# Altium schematic sheet HMC2003_module.SchDoc
size A1
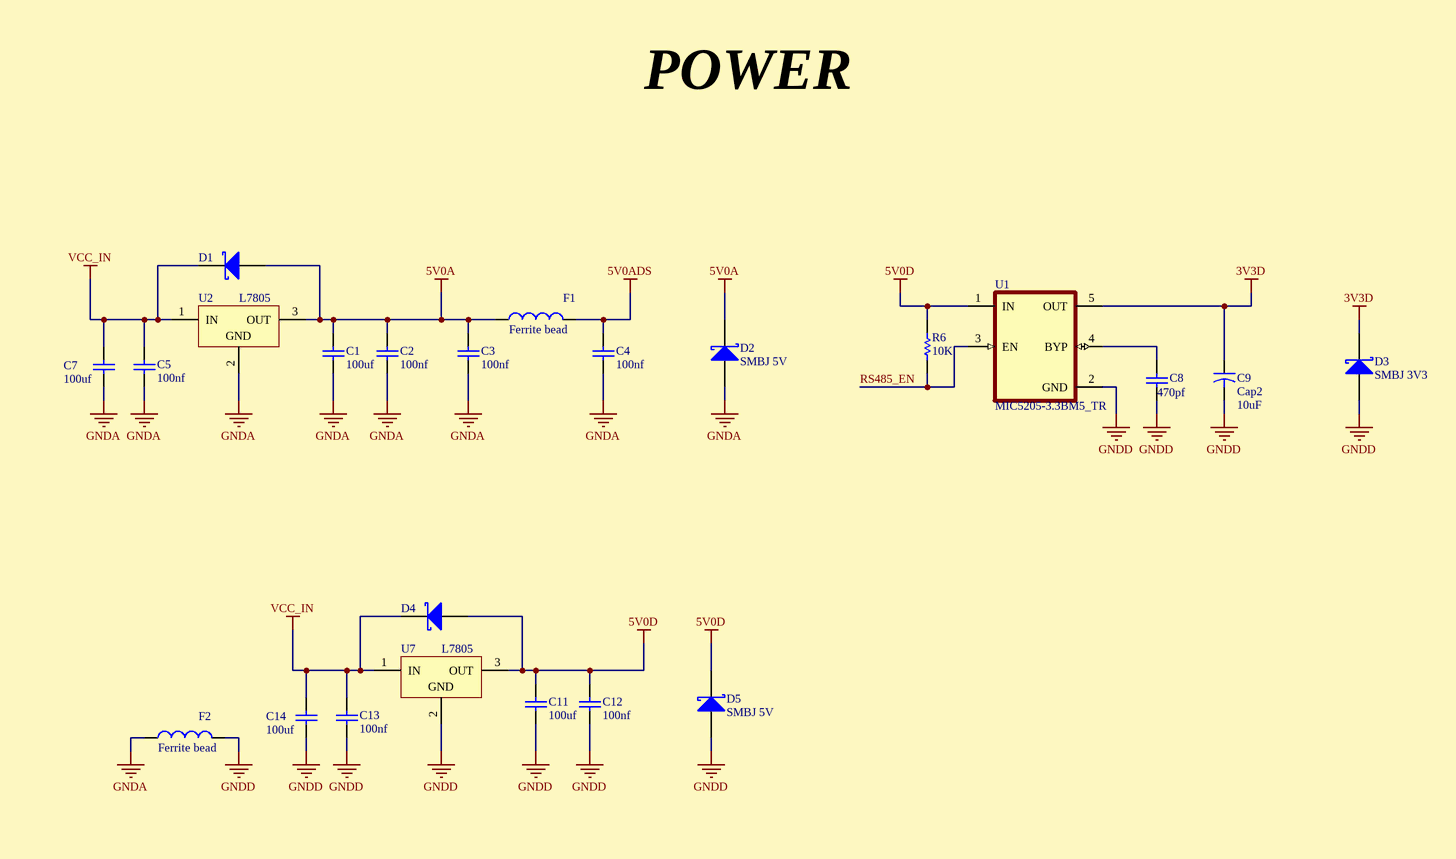
[diagram p0: HMC2003_module.SchDoc, top left]
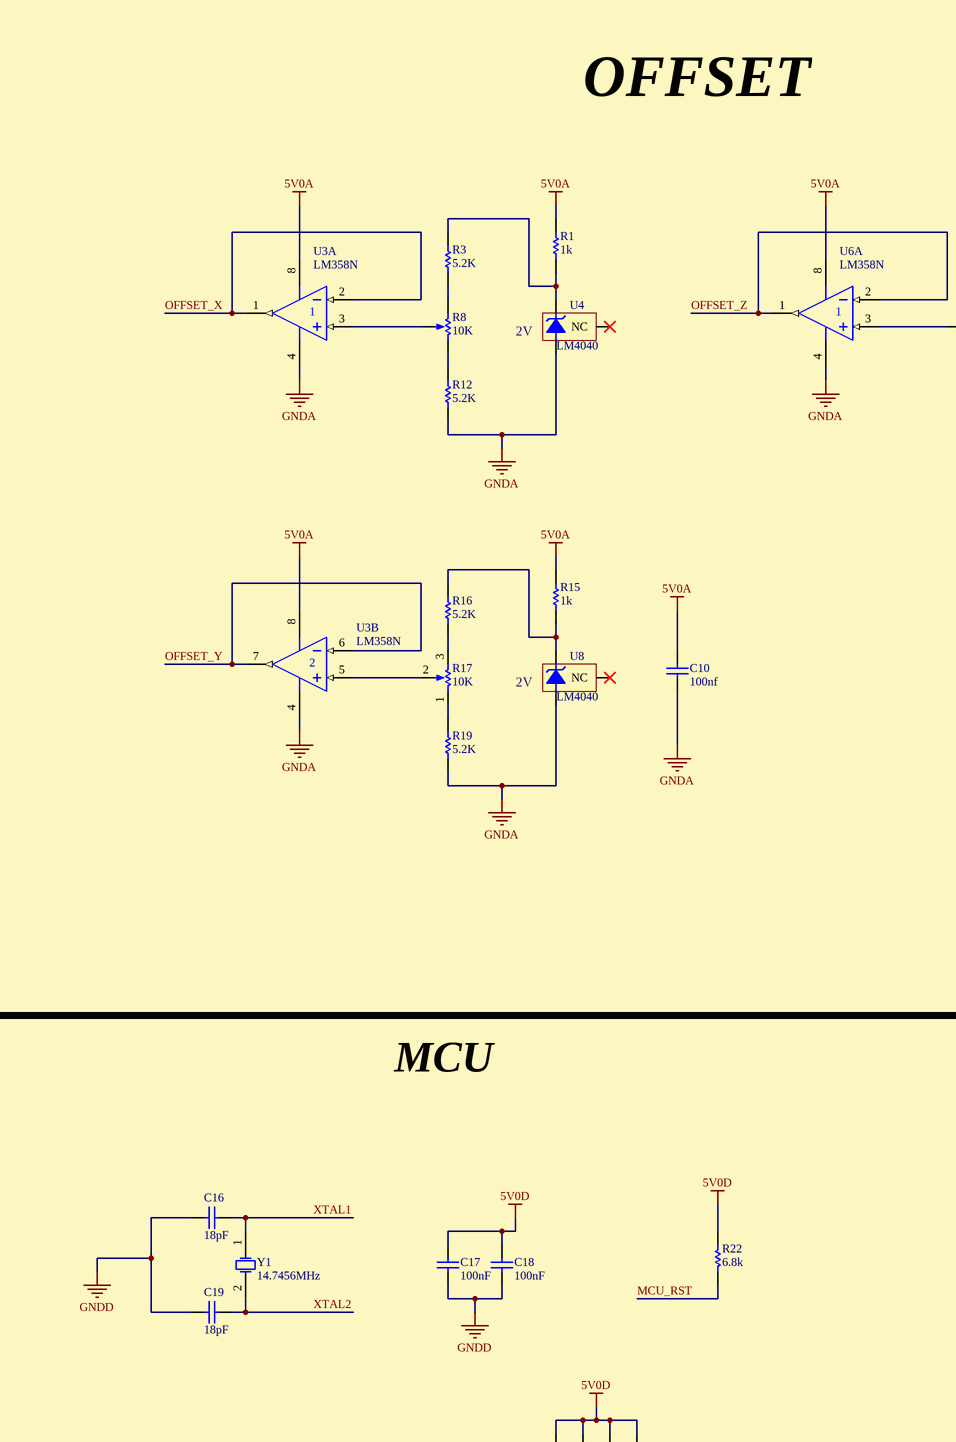
[diagram p1: HMC2003_module.SchDoc, top middle]
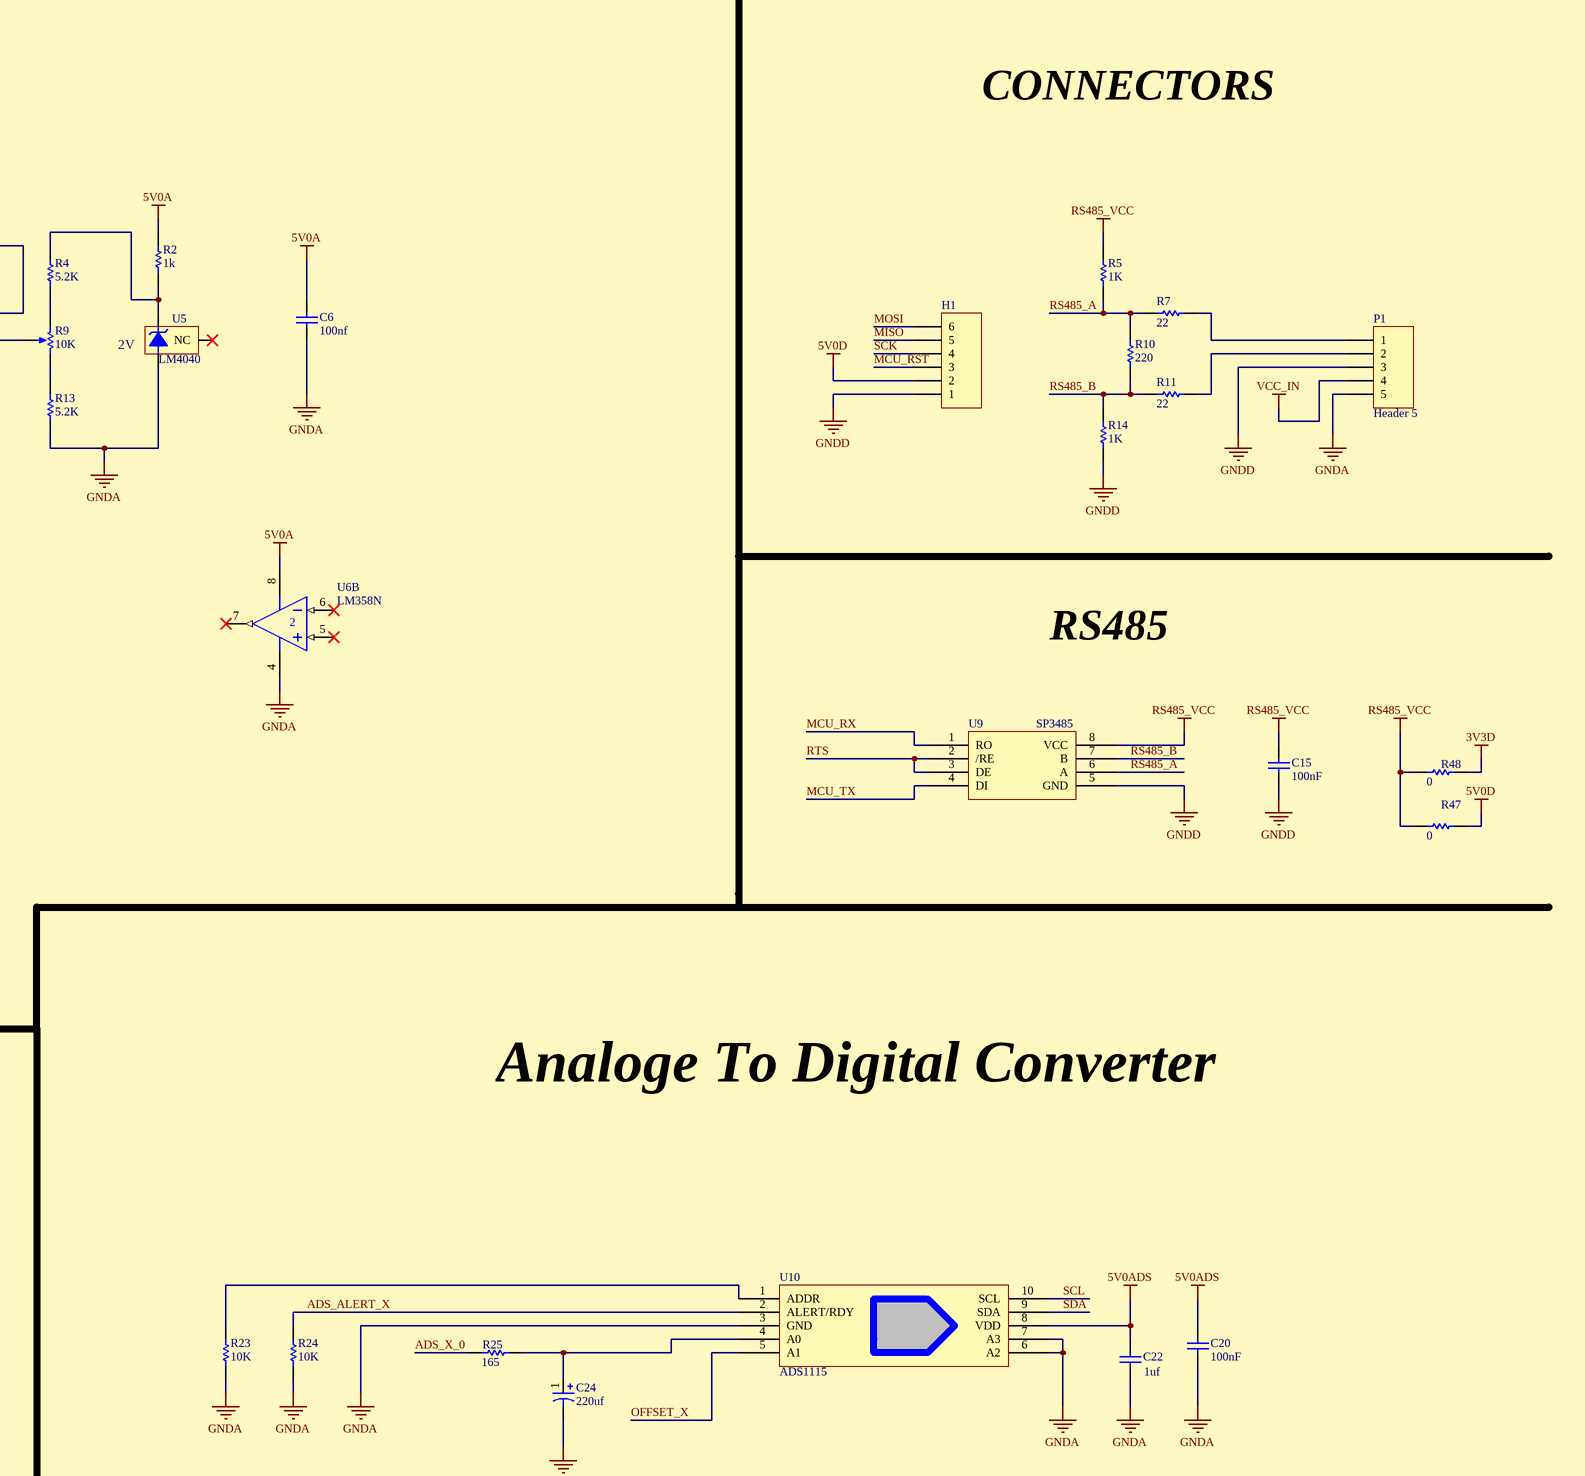
[diagram p2: HMC2003_module.SchDoc, top right]
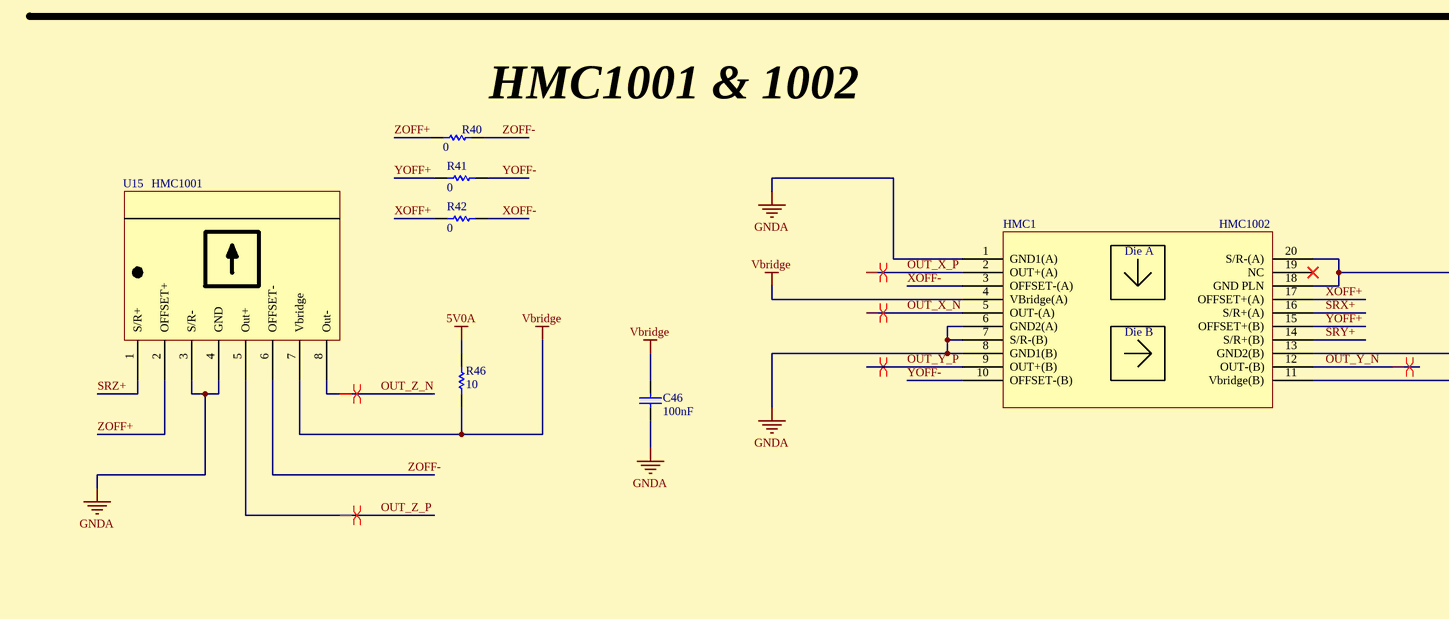
[diagram p3: HMC2003_module.SchDoc, bottom left]
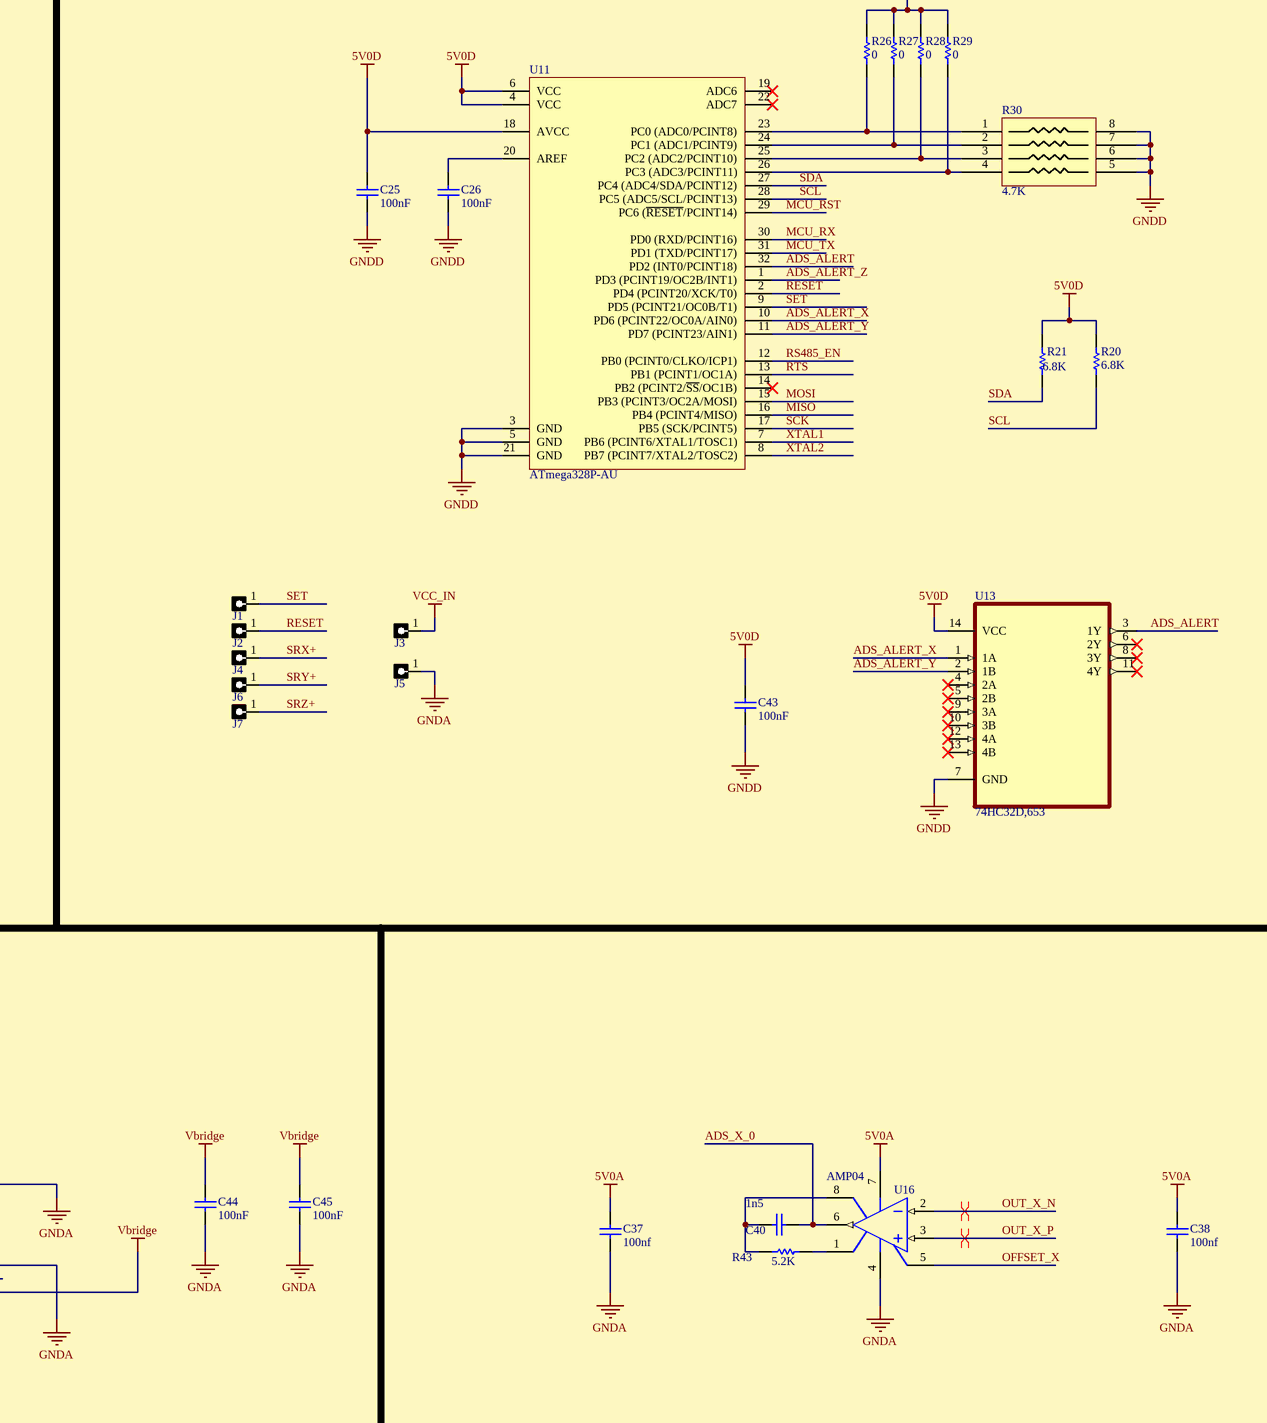
[diagram p4: HMC2003_module.SchDoc, bottom middle]
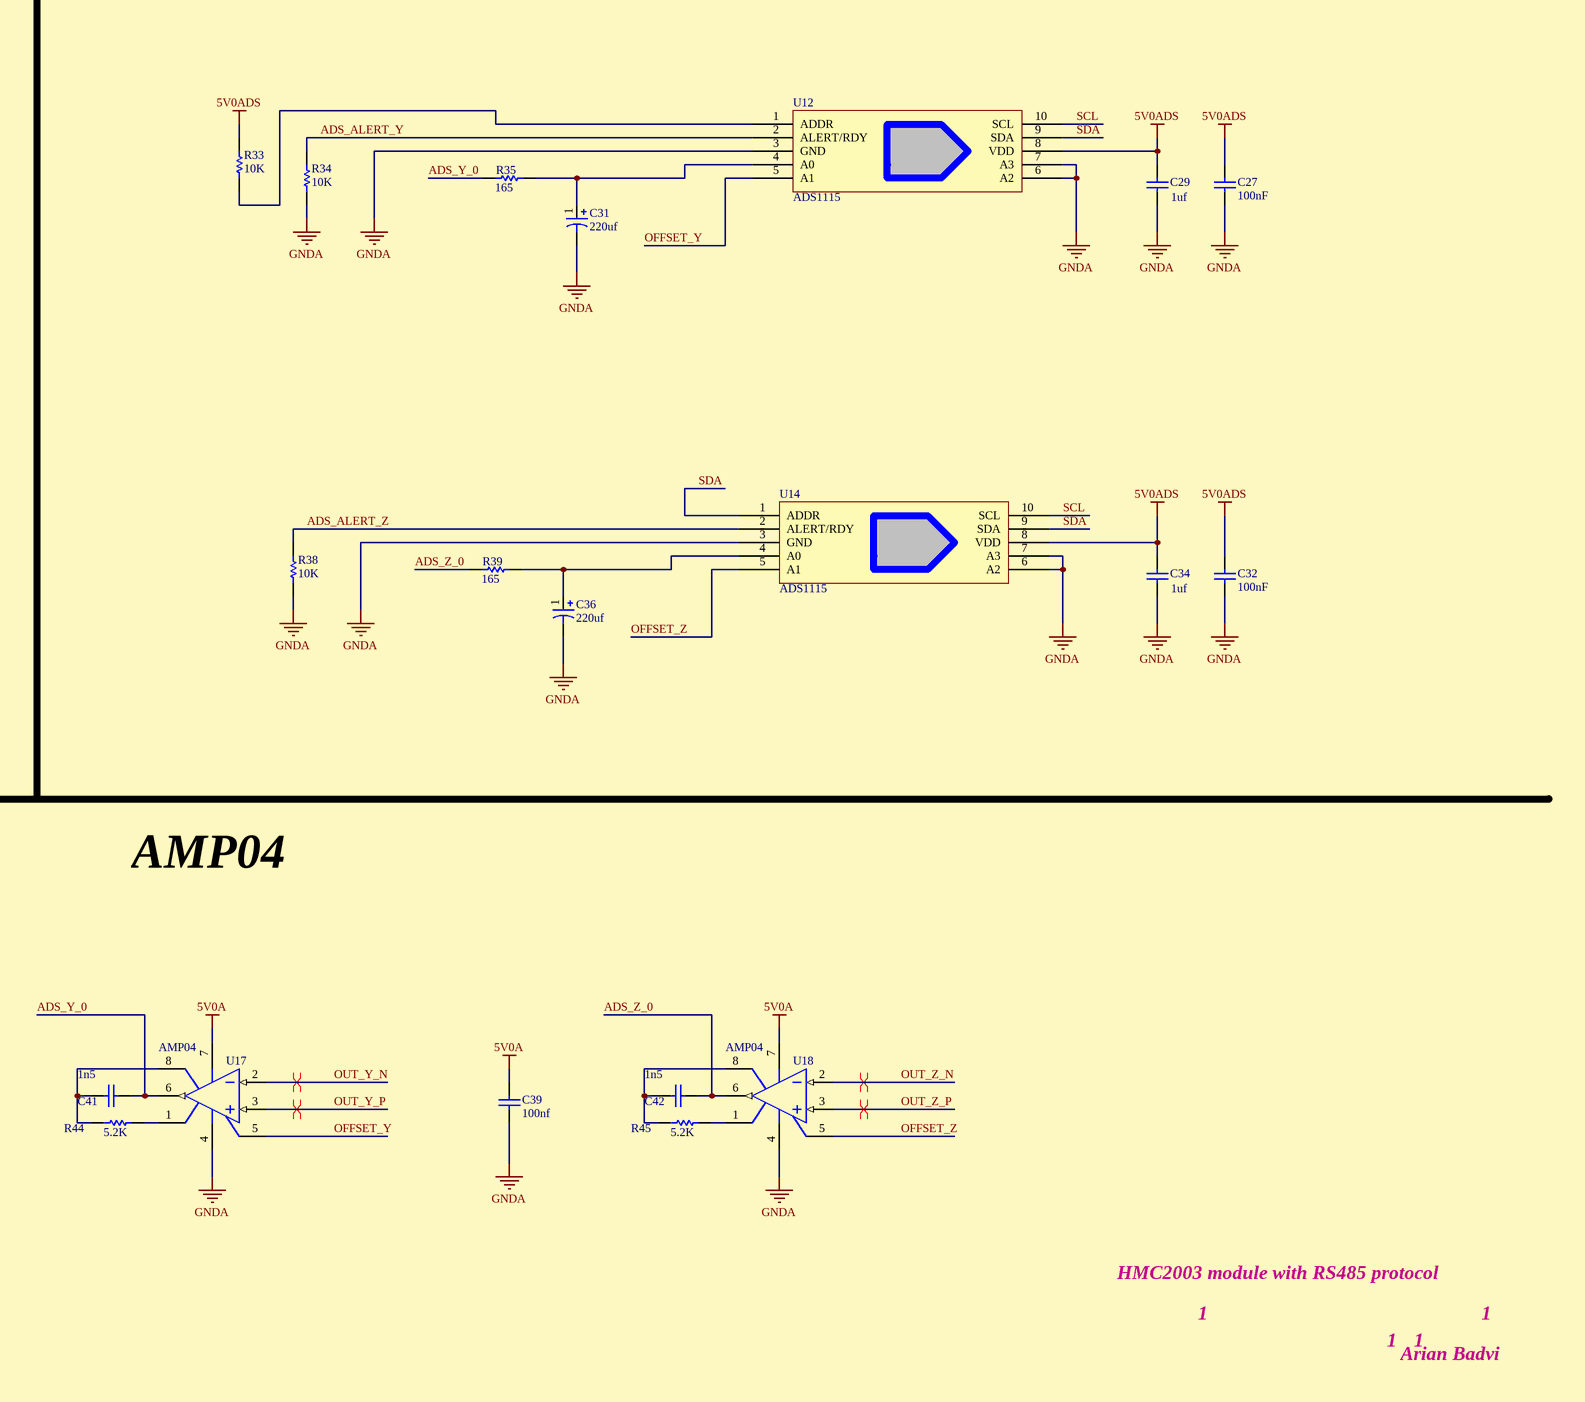
[diagram p5: HMC2003_module.SchDoc, bottom right]

## Parts
C1  100uf  [C1206]
C2  100nf  [C0805]
C3  100nf  [C0805]
C4  100nf  [C0805]
C5  100nf  [C0805]
C6  100nf  [C0805]
C7  100uf  [C1206]
C8  470pf  [C0805]
C9  Cap2  value 10uF  [CAP_SMD_A]
C10  100nf  [C0805]
C11  100uf  [C1206]
C12  100nf  [C0805]
C13  100nf  [C0805]
C14  100uf  [C1206]
C15  100nF  [C0805]
C16  18pF  [C0805]
C17  100nF  [C0805]
C18  100nF  [C0805]
C19  18pF  [C0805]
C20  100nF  [C0805]
C22  1uf  [C0805]
C24  220uf  [cap_smd_d]
C25  100nF  [C0805]
C26  100nF  [C0805]
C27  100nF  [C0805]
C29  1uf  [C0805]
C31  220uf  [cap_smd_d]
C32  100nF  [C0805]
C34  1uf  [C0805]
C36  220uf  [cap_smd_d]
C37  100nf  [C0805]
C38  100nf  [C0805]
C39  100nf  [C0805]
C40  1n5  [C0805]
C41  1n5  [C0805]
C42  1n5  [C0805]
C43  100nF  [C0805]
C44  100nF  [C0805]
C45  100nF  [C0805]
C46  100nF  [C0805]
D1  D Schottky  [ZENER]  (value not drawn)
D2  SMBJ 5V  [TVS]
D3  SMBJ 3V3  [TVS]
D4  D Schottky  [ZENER]  (value not drawn)
D5  SMBJ 5V  [TVS]
F1  Ferrite bead  [0805]
F2  Ferrite bead  [0805]
H1  White SMD Connector 6pin  [PB_6_SMD]  (value not drawn)
HMC1  HMC1002  [SO_20_W]
J1  HDRF1  [HDR_F_1]  (value not drawn)
J2  HDRF1  [HDR_F_1]  (value not drawn)
J3  HDRF1  [HDR_F_1]  (value not drawn)
J4  HDRF1  [HDR_F_1]  (value not drawn)
J5  HDRF1  [HDR_F_1]  (value not drawn)
J6  HDRF1  [HDR_F_1]  (value not drawn)
J7  HDRF1  [HDR_F_1]  (value not drawn)
P1  Header 5  [HDR_M_1x5]
R1  1k  [0805]
R2  1k  [0805]
R3  5.2K  [0805]
R4  5.2K  [0805]
R5  1K  [0805]
R6  10K  [0805]
R7  22  [0805]
R8  value 10K  [POT_3296w]  (hidden comment: RPot)
R9  value 10K  [POT_3296w]  (hidden comment: RPot)
R10  220  [0805]
R11  22  [0805]
R12  5.2K  [0805]
R13  5.2K  [0805]
R14  1K  [0805]
R15  1k  [0805]
R16  5.2K  [0805]
R17  value 10K  [POT_3296w]  (hidden comment: RPot)
R19  5.2K  [0805]
R20  6.8K  [0805]
R21  6.8K  [0805]
R22  6.8k  [0805]
R23  10K  [0805]
R24  10K  [0805]
R25  165  [0805]
R26  0  [0603]
R27  0  [0603]
R28  0  [0603]
R29  0  [0603]
R30  4.7K  [RP0603X4]
R33  10K  [0805]
R34  10K  [0805]
R35  165  [0805]
R38  10K  [0805]
R39  165  [0805]
R40  0  [0603]
R41  0  [0603]
R42  0  [0603]
R43  5.2K  [0805]
R44  5.2K  [0805]
R45  5.2K  [0805]
R46  10  [0805]
R47  0  [0603]
R48  0  [0603]
U1  MIC5205-3.3BM5_TR  [SOT23_5]
U2  L7805  [DPAK]
U3  LM358N  [sop8]  (parts A,B of 2)
U4  LM4040  [sot-23]
U5  LM4040  [sot-23]
U6  LM358N  [sop8]  (parts A,B of 2)
U7  L7805  [DPAK]
U8  LM4040  [sot-23]
U9  SP3485  [SOP8]
U10  ADS1115  [TSSOP10_N]
U11  ATmega328P-AU  [32A_L]
U12  ADS1115  [TSSOP10_N]
U13  74HC32D,653  [SOG65_14]
U14  ADS1115  [TSSOP10_N]
U15  HMC1001  [HMC1001_V]
U16  AMP04  [sop8]
U17  AMP04  [sop8]
U18  AMP04  [sop8]
Y1  14.7456MHz  [XTAL_SMD]

## Nets
3V3D: C9.1 D3.1(K) R48.1 U1.5(OUT)
5V0A: C1.2 C2.2 C3.2 C6.2 C10.2 C37.2 C38.2 C39.2 D1.1(A) D2.2(K) F1.1 R1.2 R2.2 R15.2 R46.2 U2.3(OUT) U3.8(V+) U6.8(V+) U16.7(V+) U17.7(V+) U18.7(V+)
5V0ADS: C4.2 C20.2 C22.2 C27.2 C29.2 C32.2 C34.2 F1.2 R33.2 U10.8(VDD) U12.8(VDD) U14.8(VDD)
5V0D: C11.2 C12.2 C17.2 C18.2 C25.2 C43.2 D4.1(A) D5.2(K) H1.2 R6.1 R20.1 R21.1 R22.1 R26.1 R27.1 R28.1 R29.1 R47.1 U1.1(IN) U7.3(OUT) U11.4(VCC) U11.6(VCC) U11.18(AVCC) U13.14(VCC)
GNDA: C1.1 C2.1 C3.1 C4.1 C5.1 C6.1 C7.1 C10.1 C20.1 C22.1 C24.2 C27.1 C29.1 C31.2 C32.1 C34.1 C36.2 C37.1 C38.1 C39.1 C44.1 C45.1 C46.1 D2.1(A) F2.1 HMC1.1(GND1(A)) HMC1.6(GND2(A)) HMC1.7(S/R-(B)) HMC1.8(GND1(B)) HMC1.13(GND2(B)) HMC1.18(GND_PLN) HMC1.20(S/R-(A)) J5.1 P1.5 R12.1 R13.1 R19.1 R23.1 R24.1 R34.1 R38.1 U2.2(GND) U3.4(V-) U4.2(-V) U5.2(-V) U6.4(V-) U8.2(-V) U10.3(GND) U10.6(A2) U10.7(A3) U12.3(GND) U12.6(A2) U12.7(A3) U14.3(GND) U14.6(A2) U14.7(A3) U15.3(S/R-) U15.4(GND) U16.4(V-) U17.4(V-) U18.4(V-)
GNDD: C8.1 C9.2 C11.1 C12.1 C13.1 C14.1 C15.1 C16.1 C17.1 C18.1 C19.1 C25.1 C26.1 C43.1 D3.2(A) D5.1(A) F2.2 H1.1 P1.3 R14.1 R30.5 R30.6 R30.7 R30.8 U1.2(GND) U7.2(GND) U9.5(GND) U11.3(GND) U11.5(GND) U11.21(GND) U13.7(GND)
RS485_VCC: C15.2 R5.2 R47.2 R48.2 U9.8(VCC)
Vbridge: C44.2 C45.2 C46.2 HMC1.4(VBridge(A)) HMC1.11(Vbridge(B)) R46.1 U15.7(Vbridge)
VCC_IN: C5.2 C7.2 C13.2 C14.2 D1.2(K) D4.2(K) J3.1 P1.4 U2.1(IN) U7.1(IN)
ADS_ALERT: U11.32(PD2_(INT0/PCINT18)) U13.3(1Y)
ADS_ALERT_X: R24.2 U10.2(ALERT/RDY) U11.10(PD6_(PCINT22/OC0A/AIN0)) U13.1(1A)
ADS_ALERT_Y: R34.2 U11.11(PD7_(PCINT23/AIN1)) U12.2(ALERT/RDY) U13.2(1B)
ADS_ALERT_Z: R38.2 U11.1(PD3_(PCINT19/OC2B/INT1)) U14.2(ALERT/RDY)
ADS_X_0: C40.1 R25.1 U16.6(OUT)
ADS_Y_0: C41.1 R35.1 U17.6(OUT)
ADS_Z_0: C42.1 R39.1 U18.6(OUT)
MCU_RST: H1.3 R22.2 U11.29(PC6_(~{RESET}/PCINT14))
MCU_RX: U9.1(RO) U11.30(PD0_(RXD/PCINT16))
MCU_TX: U9.4(DI) U11.31(PD1_(TXD/PCINT17))
MISO: H1.5 U11.16(PB4_(PCINT4/MISO))
MOSI: H1.6 U11.15(PB3_(PCINT3/OC2A/MOSI))
OFFSET_X: U3.1(OUT) U3.2(IN-) U10.5(A1) U16.5(OS_NUL)
OFFSET_Y: U3.6(IN-) U3.7(OUT) U12.5(A1) U17.5(OS_NUL)
OFFSET_Z: U6.1(OUT) U6.2(IN-) U14.5(A1) U18.5(OS_NUL)
OUT_X_N: HMC1.5(OUT-(A)) U16.2(IN-)
OUT_X_P: HMC1.2(OUT+(A)) U16.3(IN+)
OUT_Y_N: HMC1.12(OUT-(B)) U17.2(IN-)
OUT_Y_P: HMC1.9(OUT+(B)) U17.3(IN+)
OUT_Z_N: U15.8(Out-) U18.2(IN-)
OUT_Z_P: U15.5(Out+) U18.3(IN+)
RESET: J2.1 U11.2(PD4_(PCINT20/XCK/T0))
RS485_A: R5.1 R7.1 R10.1 U9.6(A)
RS485_B: R10.2 R11.1 R14.2 U9.7(B)
RS485_EN: R6.2 U1.3(EN) U11.12(PB0_(PCINT0/CLKO/ICP1))
RTS: U9.2(/RE) U9.3(DE) U11.13(PB1_(PCINT1/OC1A))
SCK: H1.4 U11.17(PB5_(SCK/PCINT5))
SCL: R20.2 U10.10(SCL) U11.28(PC5_(ADC5/SCL/PCINT13)) U12.10(SCL) U14.10(SCL)
SDA: R21.2 U10.9(SDA) U11.27(PC4_(ADC4/SDA/PCINT12)) U12.9(SDA) U14.1(ADDR) U14.9(SDA)
SET: J1.1 U11.9(PD5_(PCINT21/OC0B/T1))
SRX+: HMC1.16(S/R+(A)) J4.1
SRY+: HMC1.14(S/R+(B)) J6.1
SRZ+: J7.1 U15.1(S/R+)
XOFF+: HMC1.17(OFFSET+(A)) R42.2
XOFF-: HMC1.3(OFFSET-(A)) R42.1
XTAL1: C16.2 U11.7(PB6_(PCINT6/XTAL1/TOSC1)) Y1.1(OSC1)
XTAL2: C19.2 U11.8(PB7_(PCINT7/XTAL2/TOSC2)) Y1.2(OSC2)
YOFF+: HMC1.15(OFFSET+(B)) R41.2
YOFF-: HMC1.10(OFFSET-(B)) R41.1
ZOFF+: R40.2 U15.2(OFFSET+)
ZOFF-: R40.1 U15.6(OFFSET-)
NetC8_2: C8.2 U1.4(BYP)
NetC24_1: C24.1 R25.2 U10.4(A0)
NetC26_2: C26.2 U11.20(AREF)
NetC31_1: C31.1 R35.2 U12.4(A0)
NetC36_1: C36.1 R39.2 U14.4(A0)
NetC40_2: C40.2 R43.1 U16.8(TAB)
NetC41_2: C41.2 R44.1 U17.8(TAB)
NetC42_2: C42.2 R45.1 U18.8(TAB)
NetP1_1: P1.1 R7.2
NetP1_2: P1.2 R11.2
NetR1_1: R1.1 R3.2 U4.1(+V)
NetR2_1: R2.1 R4.2 U5.1(+V)
NetR3_1: R3.1 R8.3(BOT)
NetR4_1: R4.1 R9.3(BOT)
NetR8_1: R8.1(TOP) R12.2
NetR8_2: R8.2(TAP) U3.3(IN+)
NetR9_1: R9.1(TOP) R13.2
NetR9_2: R9.2(TAP) U6.3(IN+)
NetR15_1: R15.1 R16.2 U8.1(+V)
NetR16_1: R16.1 R17.3(BOT)
NetR17_1: R17.1(TOP) R19.2
NetR17_2: R17.2(TAP) U3.5(IN+)
NetR23_2: R23.2 U10.1(ADDR)
NetR26_2: R26.2 R30.1 U11.23(PC0_(ADC0/PCINT8))
NetR27_2: R27.2 R30.2 U11.24(PC1_(ADC1/PCINT9))
NetR28_2: R28.2 R30.3 U11.25(PC2_(ADC2/PCINT10))
NetR29_2: R29.2 R30.4 U11.26(PC3_(ADC3/PCINT11))
NetR33_1: R33.1 U12.1(ADDR)
NetR43_2: R43.2 U16.1(OS_NUL)
NetR44_2: R44.2 U17.1(OS_NUL)
NetR45_2: R45.2 U18.1(OS_NUL)

Not connected (* = marked no-connect by the designer): HMC1 19(NC)*; U4 3(NC)*; U5 3(NC)*; U6 5(IN+)* 6(IN-)* 7(OUT)*; U8 3(NC)*; U11 14(PB2_(PCINT2/~{SS}/OC1B))* 19(ADC6)* 22(ADC7)*; U13 4(2A)* 5(2B)* 6(2Y)* 8(3Y)* 9(3A)* 10(3B)* 11(4Y)* 12(4A)* 13(4B)*

## Layout directives
differential pair: OUT_X_N, OUT_X_P, OUT_Y_N, OUT_Y_P, OUT_Z_N, OUT_Z_P

## Notes on the sheet
- POWER
- OFFSET
- CONNECTORS
- (near U4) 2V
- (near U5) 2V
- RS485
- (near U8) 2V
- MCU
- Analoge To Digital Converter
- (near R40) HMC1001 & 1002
- AMP04
- HMC2003 module with RS485 protocol
- 1
- Arian Badvi
- (in symbol HMC1002) Die A; Die B

## Library data of the parts
C1-C5 C7 C8 C11-C14 C22 C29 C34 = Cap: Capacitor, 1206; Published: 8-Jun-2000; LatestRevisionDate: 17-Jul-2002; LatestRevisionNote: Re-released for DXP Platform.; PackageReference: RAD-0.3; Publisher: Altium Limited
  C1 C7 C11 C14: Value: 100uf
  C2-C5 C12 C13: Value: 100nf
  C8: PackageDescription: Radial Cap, Thru-Hole; 2 Leads; 0.3 in Pin Spacing; Value: 470pf
  C22 C29 C34: PackageDescription: Radial Cap, Thru-Hole; 2 Leads; 0.3 in Pin Spacing; Value: 1uf
C6 C10 C15-C20 C25-C27 C32 C37-C46 = Cap: Capacitor; Published: 8-Jun-2000; LatestRevisionDate: 17-Jul-2002; LatestRevisionNote: Re-released for DXP Platform.; PackageReference: RAD-0.3; Publisher: Altium Limited
  C6 C10 C37-C39: PackageDescription: Radial Cap, Thru-Hole; 2 Leads; 0.3 in Pin Spacing; Value: 100nf
  C15 C17 C18 C20 C25-C27 C32 C43-C46: Value: 100nF
  C16 C19: Value: 18pF
  C40-C42: PackageDescription: Radial Cap, Thru-Hole; 2 Leads; 0.3 in Pin Spacing; Value: 1n5
C9 = Cap2: Capacitor, 10uf; Published: 23-Sep-2002; PackageReference: CAPR5-4X5; Publisher: Altium Limited
C24 C31 C36 = Cap Pol1: TAN CAP D SIZE; Published: 8-Jun-2000; LatestRevisionDate: 17-Jul-2002; LatestRevisionNote: Re-released for DXP Platform.; PackageReference: RB7.6-15; Publisher: Altium Limited; PackageDescription: Polarized Capacitor (Radial); 2 Leads; Value: 220uf
D1 D4 = D Schottky: Schottky Diode, 1N4148; Published: 8-Jun-2000; LatestRevisionDate: 17-Jul-2002; LatestRevisionNote: Re-released for DXP Platform.; PackageReference: SMB; Publisher: Altium Limited; Code_JEDEC: DO-214-AA
D2 D5 = Diode 18TQ045: Schottky Rectifier; Note: Terminal 2 is the TAB and is electrically connected to the cathode; Published: 8-Jun-2000; LatestRevisionDate: 17-Jul-2002; LatestRevisionNote: Re-released for DXP Platform.; DatasheetVersion: Dec-1997; PackageVersion: Feb-1998; PackageReference: TO-220AC; Publisher: Altium Limited; ComponentLink1Description: Manufacturer Link; ComponentLink1URL: http://www.irf.com/; ComponentLink2Description: Datasheet; ComponentLink2URL: http://www.irf.com/product-info/datasheets/data/18tq.pdf
D3 = Diode 18TQ045: TVS; Note: Terminal 2 is the TAB and is electrically connected to the cathode; Published: 8-Jun-2000; LatestRevisionDate: 17-Jul-2002; LatestRevisionNote: Re-released for DXP Platform.; DatasheetVersion: Dec-1997; PackageVersion: Feb-1998; PackageReference: TO-220AC; Publisher: Altium Limited; ComponentLink1Description: Manufacturer Link; ComponentLink1URL: http://www.irf.com/; ComponentLink2Description: Datasheet; ComponentLink2URL: http://www.irf.com/product-info/datasheets/data/18tq.pdf
F1 F2 = Inductor: Ferrite bead, 1206; Code_IEC: 1005; Value: 10mH; Published: 8-Jun-2000; LatestRevisionDate: 29-May-2009; LatestRevisionNote: IPC-7351 Footprint Added.; PackageReference: 0402-A; Publisher: Altium Limited; PackageDescription: Chip Inductor; Code_JEITA: 0402
H1 = Header 6: LatestRevisionDate: 17-Jul-2002; LatestRevisionNote: Re-released for DXP Platform.; Publisher: Altium Limited
J1-J7 = HDR_F_1: CONN, HEADER, Female, pitch: 2.54mm, 1POS; VALUE: HDRF1
P1 = Header 5: Header, 5-Pin; LatestRevisionDate: 17-Jul-2002; LatestRevisionNote: Re-released for DXP Platform.; Publisher: Altium Limited
R1 R2 R15 R40-R42 R46-R48 = Resistor: Email: razi.vesali@gmail.com; Published: 17-Jun-2016; LatestRevisionNote: Re-released for puplic; Publisher: Seyed Razi Vesali
  R1 R2 R15: Value: 1k
  R40-R42 R47 R48: Value: 0
  R46: Value: 10
R3 R4 R6 R12 R13 R16 R19-R21 R23-R25 R33-R35 R38 R39 R43-R45 = Resistor: General Resistor; Published: 8-Jun-2000; LatestRevisionDate: 17-Jul-2002; LatestRevisionNote: Re-released for DXP Platform.; PackageReference: AXIAL-0.3; Publisher: Altium Limited; PackageDescription: Axial Device, Thru-Hole; 2 Leads; 0.3 in Pin Spacing
  R3 R4 R12 R13 R16 R19 R43-R45: Value: 5.2K
  R6 R23 R24 R33 R34 R38: Value: 10K
  R20 R21: Value: 6.8K
  R25 R35 R39: Value: 165
R5 R7 R10 R11 R14 = Res1: Resistor; Published: 8-Jun-2000; LatestRevisionDate: 17-Jul-2002; LatestRevisionNote: Re-released for DXP Platform.; PackageReference: AXIAL-0.3; Publisher: Altium Limited
  R5 R14: Value: 1K
  R7 R11: Value: 22
  R10: Value: 220
R8 R9 R17 = RPot: Potentiometer; Sim Note: Enter the Resistance value and the set point into parameter fields.; Set Position: 0.5; Published: 8-Jun-2000; LatestRevisionDate: 17-Jul-2002; LatestRevisionNote: Re-released for DXP Platform.; PackageReference: VR5; Publisher: Altium Limited
R22 R26-R29 = Res1: Resistor, 6.8k; Published: 8-Jun-2000; LatestRevisionDate: 17-Jul-2002; LatestRevisionNote: Re-released for DXP Platform.; PackageReference: AXIAL-0.3; Publisher: Altium Limited
  R22: Value: 6.8k
  R26-R29: Value: 0
R30 = RES_ARRAY_4: Value: 4.7K
U1 = MIC5205-3.3BM5_TR: Linear Voltage Regulator IC 1 Output 150mA SOT-23-5; MP: MIC5205-3.3BM5 TR; MF: Micrel; Package: SOT-23-5 Micrel; Value: *; Availability: Unavailable; Price: None; SnapEDA_Link: https://www.snapeda.com/parts/MIC5205-3.3BM5%20TR/Micrel/view-part/225112/?ref=snap
U2 U7 = L7805CD2T: Positive Voltage Regulator; Published: 24-Aug-2001; LatestRevisionDate: 17-Jul-2002; LatestRevisionNote: Re-released for DXP Platform.; DatasheetVersion: Dec-1998; PackageReference: TO-263; Publisher: Altium Limited; PackageDescription: D2-PAK/TO-263-AB; 3 Leads (1 Cropped); Body 15.9 (inc. leads) x 10.4 mm (LxW max); ComponentLink1Description: Manufacturer Link; ComponentLink1URL: http://www.st.com/
U3 U6 = LM358N: Dual Low-Power Operational Amplifier; Published: 17-Jul-2002; LatestRevisionDate: 06-Jun-2005; LatestRevisionNote: Stylized 3D Model Added.; DatasheetVersion: 1988; PackageReference: 626-05; Publisher: Altium Limited; PackageDescription: DIP; 8 Leads; Row Spacing 7.62 mm; Pitch 2.54 mm; ComponentLink1Description: Manufacturer Link; ComponentLink1URL: http://www.onsemi.com/site/products/parametrics/0,4446,251,00.html; ComponentLink2Description: Datasheet; ComponentLink2URL: http://www.onsemi.com/pub/Collateral/LM358-D.PDF
U4 U5 U8 = LM4040: Precision Micropower Shunt Voltage Reference, 3-pin SOT-23; PartNumber: LM4040DIM3-10.0; Manufacturer: National Semiconductor; PackageTopMarking: R0D*XTT; PowerWise: N; CompType: Voltage Reference IC; Published: 4-Dec-2008; DatasheetVersion: Apr-2005; PackageVersion: revB, Mar-2003; PackageReference: MF03A; Publisher: Altium Limited; PackageDescription: Molded SOT-23, .115 x .051 x .037in Body, 3 Lead, .075 in Pitch; RoHS: N; PinCount: 3; ComponentLink1Description: LM4040 Datasheet; ComponentLink1URL: http://www.national.com/ds/LM/LM4040.pdf; ComponentLink2Description: LM4040 Web Page; ComponentLink2URL: http://www.national.com/pf/LM/LM4040.html; ComponentLink3Description: MF03A Package Page; ComponentLink3URL: http://www.national.com/packaging/folders/mf03a.html
U9 = rs485
U11 = ATmega328P-AU: 8-bit AVR Microcontroller, 32KB Flash, 1KB EEPROM, 2KB SRAM, 32-pin TQFP, Industrial Grade (-40°C to 85°C); Published: 1-Apr-2010; DatasheetVersion: revA, Jan-2010; PackageVersion: revB, Oct-2001; PackageReference: 32A; Publisher: Altium Limited; PackageDescription: 32-Lead, 7x7x1.0 mm Body, 0.8mm Lead Pitch, Thin Profile Plastic Quad Flat Package (TQFP); Supplier 1: Digi-Key; Supplier Part Number 1: ATMEGA328P-AU-ND; Supplier 2: Farnell; Supplier Part Number 2: 1715486; Supplier 3: Mouser; Supplier Part Number 3: 556-ATMEGA328P-AU; Code_JEDEC: MS-026-ABA; ComponentLink1Description: Manufacturer Link; ComponentLink1URL: http://www.atmel.com/products/avr/default.asp?; ComponentLink2Description: ATmega48A/48PA/88A/88PA/168A/168PA/328/328P Datasheet; ComponentLink2URL: http://www.atmel.com/dyn/resources/prod_documents/8271.pdf; ComponentLink3Description: ATmega48A/48PA/88A/88PA/168A/168PA/328/328P Summary; ComponentLink3URL: http://www.atmel.com/dyn/resources/prod_documents/8271S.pdf; ComponentLink4Description: Atmel.com Home; ComponentLink4URL: http://www.atmel.com
U13 = 74HC32D,653: OR Gate IC 4 Channel 14-SO; MF: Nexperia USA; MP: 74HC32D,653; Price: None; SnapEDA_Link: https://www.snapeda.com/parts/74HC32D,653/Nexperia%20USA%20Inc./view-part/33189/?ref=snap; Package: SOIC-14 NXP Semiconductors; DigiKey-Purchase-URL: https://snapeda.com/shop?store=DigiKey&id=33189; Value: *; Mouser-Purchase-URL: https://snapeda.com/shop?store=Mouser&id=33189; Availability: Good
U16-U18 = Op Amp: Published: 8-Jun-2000; LatestRevisionDate: 17-Jul-2002; LatestRevisionNote: Re-released for DXP Platform.; DatasheetVersion: REV. B; PackageVersion: 1990; PackageReference: H-08A; Publisher: Altium Limited; PackageDescription: Can; 8 Leads; Pin Circle Dia. 5.08 mm; Lead Dia. 0.53 mm (max); ComponentLink1Description: Manufacturer Link; ComponentLink1URL: http://www.analog.com/
Y1 = XTAL: Crystal Oscillator, 14.7456KHz; Published: 8-Jun-2000; LatestRevisionDate: 17-Jul-2002; LatestRevisionNote: Re-released for DXP Platform.; PackageReference: R38; Publisher: Altium Limited